# EAGLE design QwiicTOFModule (EAGLE 8.4.1)
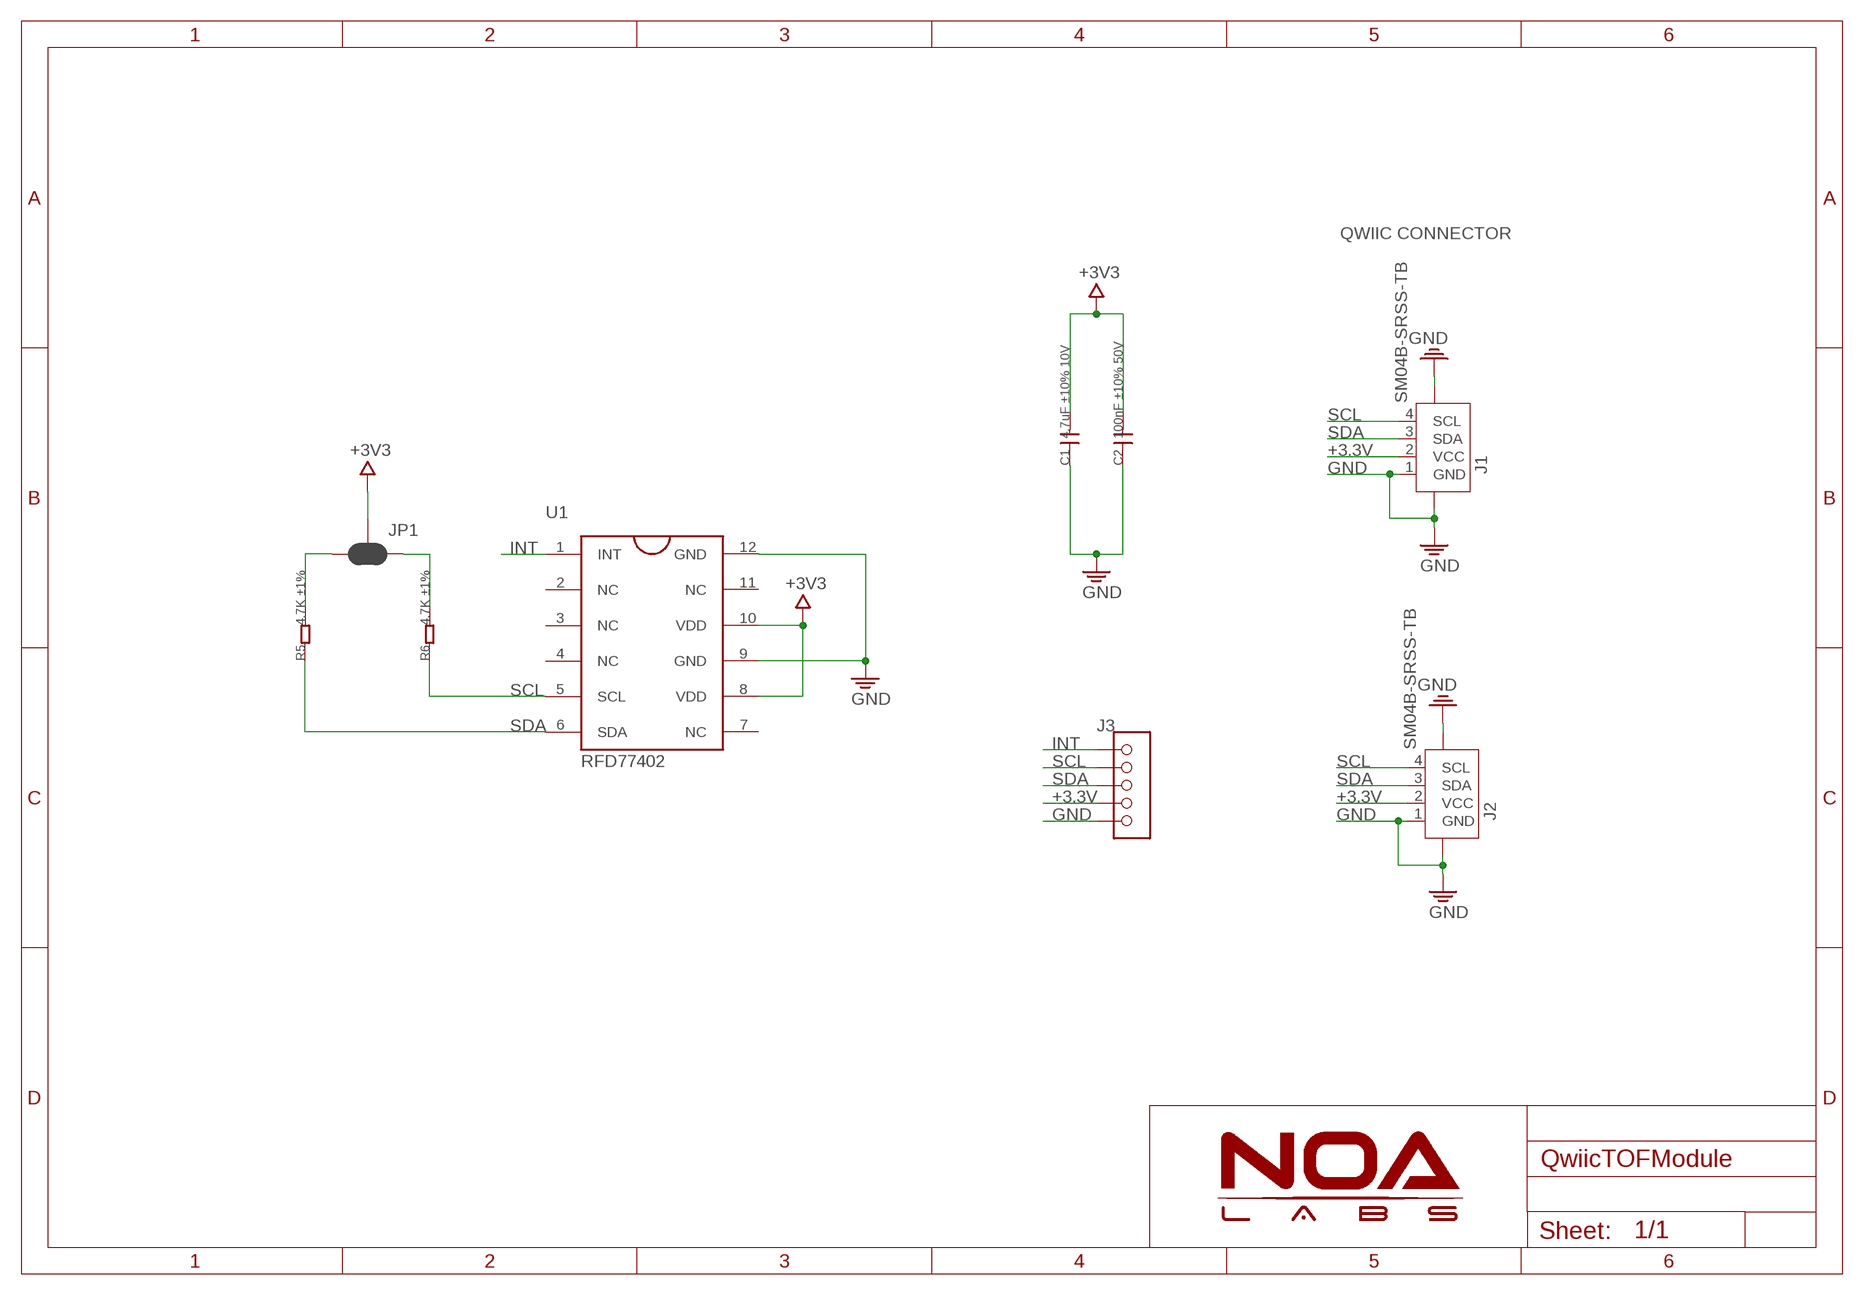
[diagram p0: schematic, sheet 1]

## Parts
C1  4.7uF ±10% 10V  C-0603  [0603]
C2  100nF ±10% 50V  C-0603  [0603]
J1  SM04B-SRSS-TB  JST-SH-4P-1.0  [JST-SH-4P]
J2  SM04B-SRSS-TB  JST-SH-4P-1.0  [JST-SH-4P]
J3  HEADER-5P-2.54  [5P-2.54]
JP1  JUMPER-SMT_3_2-NC_PASTE_SILK  [SMT-JUMPER_3_2-NC_PASTE_SILK]
R5  4.7K ±1%  R-0603  [0603]
R6  4.7K ±1%  R-0603  [0603]
U1  RFD77402  [RFD77402]

## Nets
+3.3V: C1.2 C2.2 J1.2(VCC) J2.2(VCC) J3.4 JP1.2 U1.8(VDD) U1.10(VDD) ; supply symbol labelled +3V3
GND: C1.1 C2.1 J1.1(GND) J1.NC1 J1.NC2 J2.1(GND) J2.NC1 J2.NC2 J3.5 U1.9(GND) U1.12(GND)
INT: J3.1 U1.1(INT)
N$2: JP1.3 R5.2
N$3: JP1.1 R6.2
SCL: J1.4(SCL) J2.4(SCL) J3.2 R6.1 U1.5(SCL)
SDA: J1.3(SDA) J2.3(SDA) J3.3 R5.1 U1.6(SDA)
Unconnected: U1.2(NC) U1.3(NC) U1.4(NC) U1.7(NC) U1.11(NC)

## Notes on the sheet
- QWIIC CONNECTOR

## Library data of the parts
C1 C2 = Discretex:C*: Ceramic Capacitors
J1 J2 = Connector:JST-SH-4P
J3 = Connector:HEADER-5P
JP1 = SparkFun-Jumpers:JUMPER-SMT_3_2-NC_PASTE: Normally closed solder jumper (2 of 2 connections) This jumper has an aperture in the stencil to allow solder paste to bridge both connections. Both connections are normally closed (NC). Wick off the solder to open the connection(s). Reapply solder to reclose the connection(s).
R5 R6 = Discretex:R*
U1 = RFD77402:RFD77402

## Board
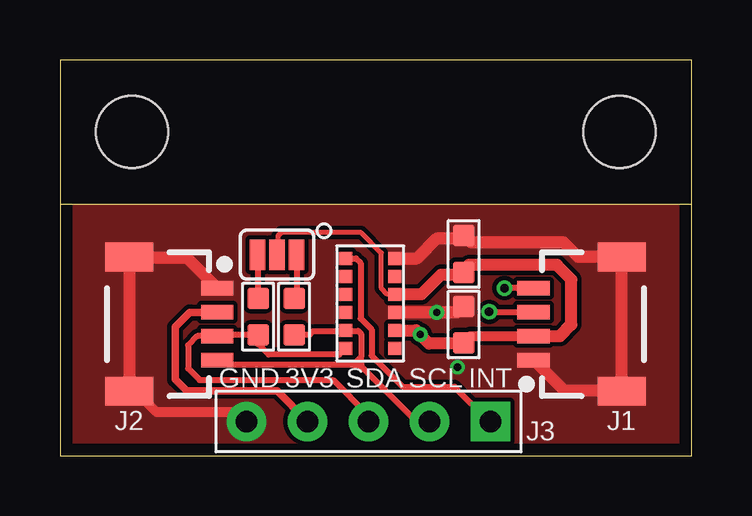
[diagram p1: board, top side]
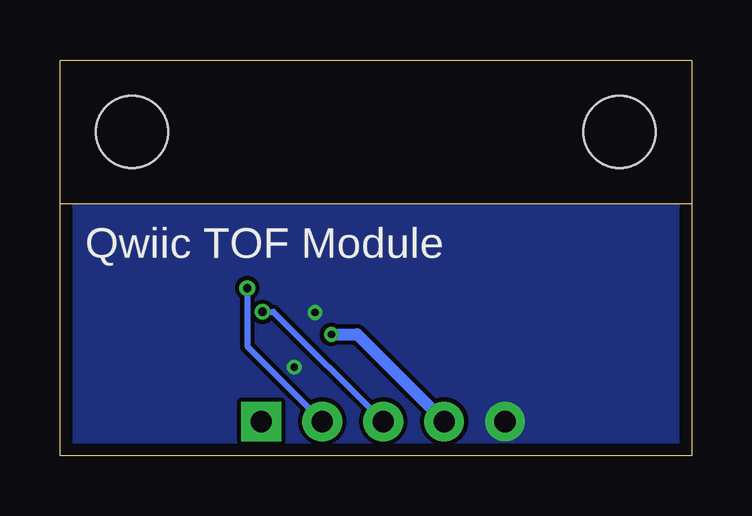
[diagram p2: board, bottom side, seen from below]

Size 26.32 x 16.5 mm. Coordinates in mm from the lower left corner, seen from the top.
Outline: 0,0 26.32,0 26.32,16.5 0,16.5 0,0
Copper layers (1*16): Top 0.035mm / dielectric 1.5mm / Bottom 0.035mm
Design rules "NOA Eagle Rule": minimum track width 7mil, minimum drill 12mil, track to track 7mil, track to pad 7mil, pad to pad 7mil, via to via 7mil, smd to smd 0mil, copper to edge 20mil, drill to drill 10mil, minimum pad ring 10mil, minimum via ring 6mil, stop-mask expansion 2mil, vias tented up to drill 25mil, thermal gap 10mil
Holes 3 mm at 3,13.5 23.32,13.5
Milling: 1 lines

### Footprints (pad centres in the part's own frame; a part is rotated, then mirrored left to right if it is on the bottom)
0603 = smd 0.889 x 0.889: 1 -0.762,0; 2 0.762,0
JST-SH-4P = smd 0.6 x 1.35: 1 1.5,0; 2 0.5,0; 3 -0.5,0; 4 -1.5,0 | smd 1.2 x 2: NC1 -2.8,3.675; NC2 2.8,3.675
5P-2.54 = drill 0.889 pad 1.651 square: 1 0,5.08 | drill 0.889 pad 1.651: 2 0,2.54; 3 0,0; 4 0,-2.54; 5 0,-5.08
SMT-JUMPER_3_2-NC_PASTE_SILK = smd 0.635 x 1.27: 1 -0.813,0; 2 0,0; 3 0.813,0
RFD77402 = smd 0.55 x 0.55: 1 1.875,1.025; 2 1.125,1.025; 3 0.375,1.025; 4 -0.375,1.025; 5 -1.125,1.025; 6 -1.875,1.025; 7 -1.875,-1.025; 8 -1.125,-1.025; 9 -0.375,-1.025; 10 0.375,-1.025; 11 1.125,-1.025; 12 1.875,-1.025

### Placement (x,y rotation side)
C1  16.81,5.46 270 top
C2  16.81,8.41 270 top
E$3  [6MM]  5.31,6.32 0 bottom
J1  19.74,5.49 270 top
J2  6.55,5.49 90 top
J3  12.85,1.42 270 top
JP1  9.04,8.38 180 top
R5  8.26,5.79 90 top
R6  9.75,5.79 90 top
U1  12.93,6.35 90 top

### Tracks (layer width: path | path; a pad name or v marks a point on that pad's centre or on a via)
+3.3V  (via drill 0.3)
  Top 0.203: U1.10 13.65,6.72 13.39,6.99 13.39,8.46 12.55,9.3 9.22,9.3 9.09,9.17 9.09,8.43 JP1.2
  Top 0.305: J3.4 9.04,2.69 5.28,2.69 4.8,3.17 4.8,5.36 5.41,5.97 6.54,5.97 J2.2
  Top 0.406: J1.2 17.1,4.99 C1.2
  Top 0.508: J1.2 20.84,4.99 21.31,5.46 21.31,7.34 20.7,7.95 17.04,7.95 C2.2 16.64,7.54 15.88,7.54 15.06,6.72 U1.10 | C1.2 16.79,4.67 15.37,4.67 14.82,5.22 | U1.8 14.82,5.22 | v15.01,5.05 14.84,5.22 14.82,5.22
  Bottom 0.508: v15.01,5.05 13.95,5.05 J3.4
GND  (via drill 0.3)
  Top 0.406: J3.5 7.39,1.8 4.04,1.8 3.16,2.69 J2.NC1
  Top 0.508: 2.88,8.23 J2.NC1 | 2.88,8.23 J2.NC2 | J2.1 5.31,8.23 2.88,8.23 | 23.41,2.72 J1.NC1 21.58,8.29 20.98,8.89 17.12,8.89 C2.1 16.64,9.07 15.72,9.07 14.88,8.22 U1.12 | 23.41,2.72 J1.NC2 | J1.1 21,2.72 23.41,2.72 | 16.57,5.97 U1.9 | 16.57,5.97 C1.1 | v15.7,5.97 16.57,5.97
  other vias: 16.56,3.68
  pour Bottom (no thermals): 0,10.49 0,0 26.31,0 26.31,10.49
  pour Top (no thermals): 0,10.49 26.31,10.49 26.31,0 0,0
INT
  Top 0.254: U1.1 12.32,8.22 12.52,8.03 12.52,5.72 12.98,5.26 12.98,4.17 14.28,2.87 16.43,2.87 17.88,1.42 J3.1
N$2
  Top 0.254: JP1.3 8.23,6.58 R5.2
N$3
  Top 0.254: JP1.1 9.86,6.66 R6.2
SCL  (via drill 0.35)
  Top 0.254: 19.05,6.99 J1.4 v18.52,6.99 | R6.1 10.39,5.03 10.54,5.18 11.86,5.18 U1.5 11.92,5.21 12.42,5.21 12.55,5.08 12.55,4.12 | 12.55,4.12 12.22,3.79 | 12.22,3.79 6.75,3.79 J2.4 | J3.2 14.83,1.42 12.55,3.71 12.55,3.83 | 12.55,3.83 12.55,4.12 | 12.22,3.79 12.5,3.79 12.55,3.83
  Bottom 0.254: v18.52,6.99 18.52,4.55 J3.2
SDA  (via drill 0.35)
  Top 0.254: 19.07,5.99 J1.3 v17.89,5.99 v17.88,5.99 | U1.6 11.64,4.22 8.69,4.22 8.26,4.65 R5.1 6.6,5.03 J2.3 5.72,4.99 5.33,4.6 5.33,3.63 5.82,3.15 11.38,3.15 12.85,1.68 J3.3
  Bottom 0.254: v17.88,5.99 17.42,5.99 J3.3

### Text on the board
tPlace: GND | 3V3 | SDA | SCL | INT
bPlace: Qwiic TOF Module